# Altium schematic sheet Ricky and Min Lin - ART Robot.SchDoc: CPLD Daughter Board for Arduino Uno
size Tabloid; Date: 01/15/2011; Author: PB; CompanyName: Hikaritech inc.; DrawnBy: PB; Engineer: PB; Address1: 29-1560 Prince St; Address2: Port-Moody, BC; Address3: V3H 3W8; Address4: pbelangerconsulting@gmail.com; Revision: 1.0; SheetNumber: 1; SheetTotal: 1; ModifiedDate: 03/08/2008; ProjectName: Project Name
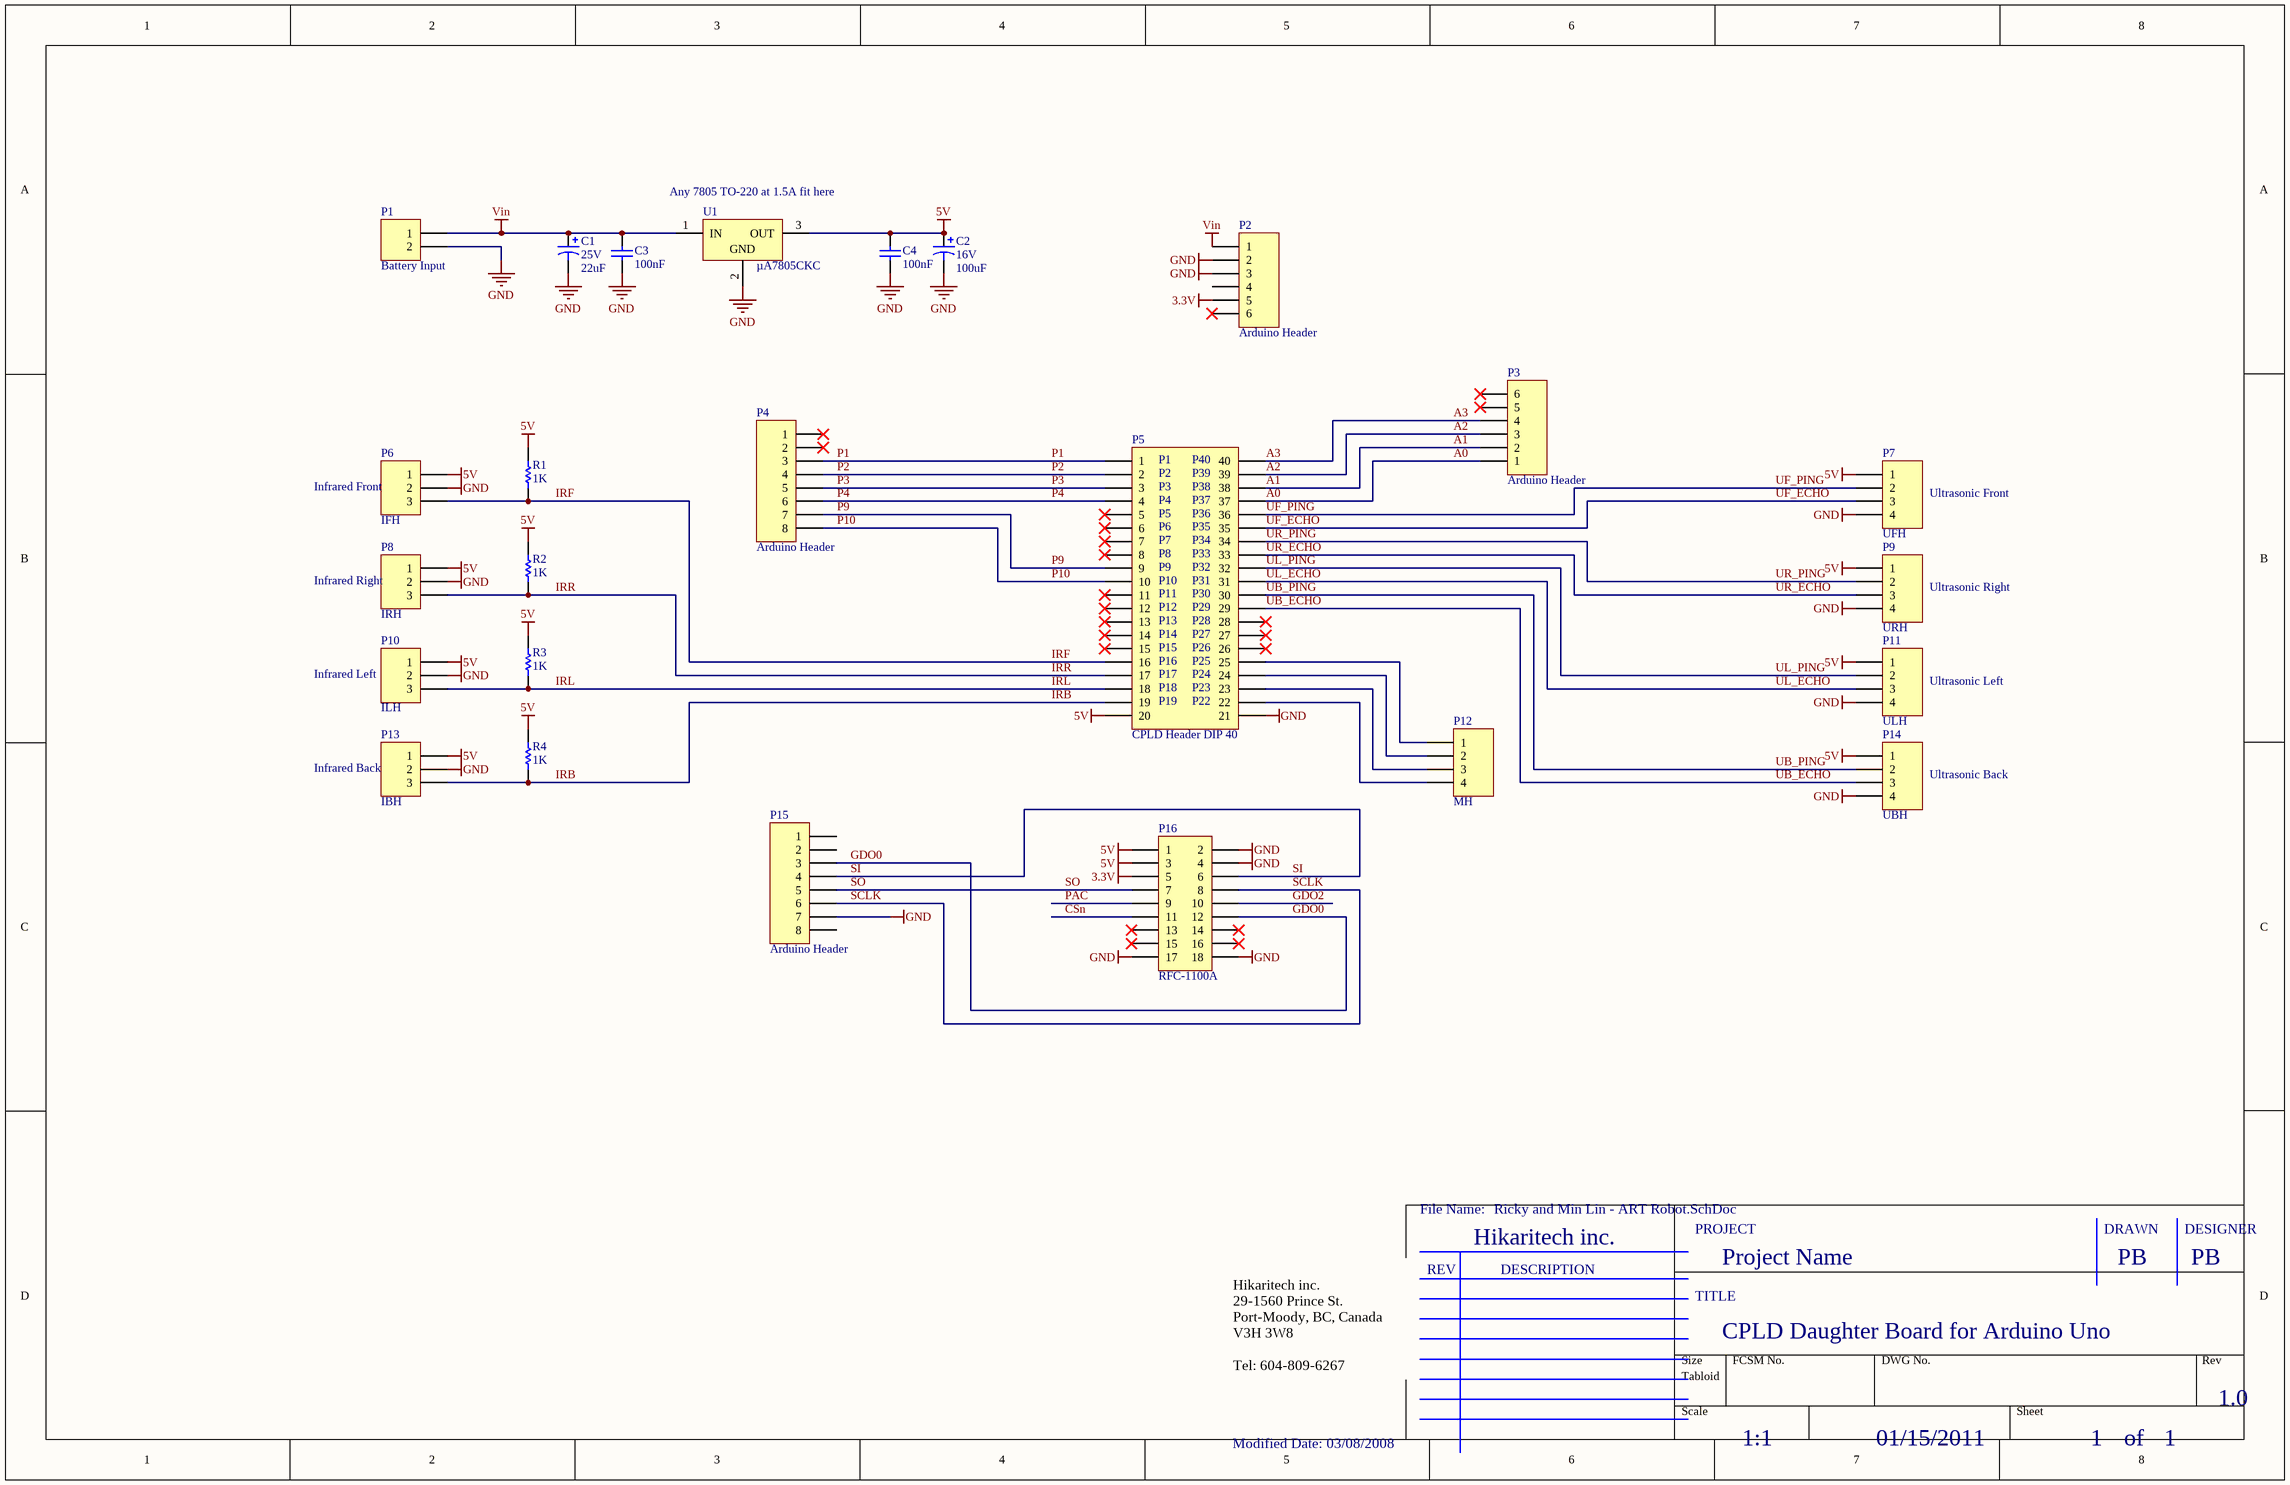
[diagram p0: Ricky and Min Lin - ART Robot.SchDoc]

## Parts
C1  25V  value 22uF  [E]
C2  16V  value 100uF  [E]
C3  value 100nF  [VP41-2.5]  (hidden comment: VP41BY104)
C4  value 100nF  [VP41-2.5]  (hidden comment: VP41BY104)
P1  Battery Input  [HDR1X2H]
P2  Arduino Header  [HDR1X6]
P3  Arduino Header  [HDR1X6]
P4  Arduino Header  [HDR1X8]
P5  CPLD Header DIP 40  [DIP-40]
P6  IFH  [HDR1X3H]
P7  UFH  [HDR1X4H]
P8  IRH  [HDR1X3H]
P9  URH  [HDR1X4H]
P10  ILH  [HDR1X3H]
P11  ULH  [HDR1X4H]
P12  MH  [HDR1X4]
P13  IBH  [HDR1X3H]
P14  UBH  [HDR1X4H]
P15  Arduino Header  [HDR1X8]
P16  RFC-1100A  [HDR2X9]
R1  value 1K  [AXIAL-0.3]  (hidden comment: Res1)
R2  value 1K  [AXIAL-0.3]  (hidden comment: Res1)
R3  value 1K  [AXIAL-0.3]  (hidden comment: Res1)
R4  value 1K  [AXIAL-0.3]  (hidden comment: Res1)
U1  µA7805CKC  [KC03]

## Nets
3.3V: P2.5 P16.5
5V: C2.1 C4.1 P5.20 P6.1 P7.1 P8.1 P9.1 P10.1 P11.1 P13.1 P14.1 P16.1 P16.3 R1.2 R2.2 R3.2 R4.2 U1.3(OUT)
GND: C1.2 C2.2 C3.2 C4.2 P1.2 P2.2 P2.3 P5.21 P6.2 P7.4 P8.2 P9.4 P10.2 P11.4 P13.2 P14.4 P15.7 P16.2 P16.4 P16.17 P16.18 U1.2(GND)
Vin: C1.1 C3.1 P1.1 P2.1 U1.1(IN)
A0: P3.1 P5.37
A1: P3.2 P5.38
A2: P3.3 P5.39
A3: P3.4 P5.40
CSn: P16.11
GDO0: P15.3 P16.12
GDO2: P16.10
IRB: P5.19 P13.3 R4.1
IRF: P5.16 P6.3 R1.1
IRL: P5.18 P10.3 R3.1
IRR: P5.17 P8.3 R2.1
P1: P4.3 P5.1
P2: P4.4 P5.2
P3: P4.5 P5.3
P4: P4.6 P5.4
P9: P4.7 P5.9
P10: P4.8 P5.10
PAC: P16.9
SCLK: P15.6 P16.8
SI: P15.4 P16.6
SO: P15.5 P16.7
UB_ECHO: P5.29 P14.3
UB_PING: P5.30 P14.2
UF_ECHO: P5.35 P7.3
UF_PING: P5.36 P7.2
UL_ECHO: P5.31 P11.3
UL_PING: P5.32 P11.2
UR_ECHO: P5.33 P9.3
UR_PING: P5.34 P9.2
NetP5_22: P5.22 P12.4
NetP5_23: P5.23 P12.3
NetP5_24: P5.24 P12.2
NetP5_25: P5.25 P12.1

Not connected (* = marked no-connect by the designer): P2 4 6*; P3 5* 6*; P4 1* 2*; P5 5* 6* 7* 8* 11* 12* 13* 14* 15* 26* 27* 28*; P15 1 2 8; P16 13* 14* 15* 16*

## Notes on the sheet
- (near U1) Any 7805 TO-220 at 1.5A fit here
- (near P6) Infrared Front
- (near P5) P1
- (near P5) P2
- (near P5) P3
- (near P5) P40
- (near P5) P39
- (near P5) P38
- (near P7) Ultrasonic Front
- (near P5) P4
- (near P5) P5
- (near P5) P6
- (near P5) P7
- (near P5) P8
- (near P5) P9
- (near P5) P37
- (near P5) P36
- (near P5) P35
- (near P5) P34
- (near P5) P33
- (near P5) P32
- (near P8) Infrared Right
- (near P5) P10
- (near P5) P11
- (near P5) P12
- (near P5) P13
- (near P5) P31
- (near P5) P30
- (near P5) P29
- (near P5) P28
- (near P9) Ultrasonic Right
- (near P10) Infrared Left
- (near P5) P14
- (near P5) P15
- (near P5) P16
- (near P5) P17
- (near P5) P18
- (near P5) P19
- (near P5) P27
- (near P5) P26
- (near P5) P25
- (near P5) P24
- (near P5) P23
- (near P5) P22
- (near P11) Ultrasonic Left
- (near P13) Infrared Back
- (near P14) Ultrasonic Back
- File Name:
- PROJECT
- DRAWN
- DESIGNER
- REV
- DESCRIPTION
- TITLE
- Hikaritech inc.
  29-1560 Prince St.
  Port-Moody, BC, Canada
  V3H 3W8
  Tel: 604-809-6267
- Modified Date:
- 1:1
- of

## Library data of the parts
C1 = 94SC226X0025EBP: Solid Aluminum Capacitor with Organic Semiconductor Electrolyte: 22uF, 25V, Bulk Pack; Note: Part Numbers shown are for ± 20% capacitance tolerance (X0).; PCB_Layout: Complies with Manufacturer's Recommendation.; DrillSize: Nominal, Rounded to the nearest 0.1mm; Published: 19-Mar-2004; DatasheetDocument: 23-May-2001; PackageReference: E; Publisher: Altium Limited; ComponentLink1Description: Manufacturer Link; ComponentLink1URL: http://www.vishay.com/; ComponentLink2Description: Datasheet; ComponentLink2URL: http://www.vishay.com/docs/90004/94sc.pdf
C2 = 94SH107X0016EBP: Solid Aluminum Capacitor with Organic Semiconductor Electrolyte: 100uF, 16V, Bulk Pack; Note: Part Numbers shown are for ± 20% capacitance tolerance (X0).; PCB_Layout: Complies with Manufacturer's Recommendation.; DrillSize: Nominal, Rounded to the nearest 0.1mm; Published: 19-Mar-2004; DatasheetDocument: 23-May-2001; PackageReference: E; Publisher: Altium Limited; ComponentLink1Description: Manufacturer Link; ComponentLink1URL: http://www.vishay.com/; ComponentLink2Description: Datasheet; ComponentLink2URL: http://www.vishay.com/docs/90006/94sh.pdf
C3 C4 = VP41BY104: Dipped Radial Multilayer Ceramic Capacitor X7R: 100nF; Note: See Datasheet for other packages & tolerances; Published: 17-Dec-2003; DatasheetDocument: 4-Feb-2002; PackageDocument: 4-Feb-2002; PackageReference: VP41-2.5; Publisher: Altium Limited; ComponentLink1Description: Manufacturer Link; ComponentLink1URL: http://www.vishay.com/
P1 = CONN 2 PIN 2.54mm Latch RA Tin: CONN 2 PINS 2.54mm Wire to Board Latch RA Tin; Manufacturer: CKMOLD; Manufacturer Part Number: 25430202; Color: Black
P2 P3 = Header 6: Header, 6-Pin; LatestRevisionDate: 17-Jul-2002; LatestRevisionNote: Re-released for DXP Platform.; Publisher: Altium Limited
P4 P15 = Header 8: Header, 8-Pin; LatestRevisionDate: 17-Jul-2002; LatestRevisionNote: Re-released for DXP Platform.; Publisher: Altium Limited
P5 = Header DIP 40: Header, 20-Pin, Dual row; LatestRevisionDate: 17-Jul-2002; LatestRevisionNote: Re-released for DXP Platform.; Publisher: Altium Limited
P6 P8 P10 P13 = CONN 3 PIN 2.54mm Latch RA Tin: CONN 3 PINS 2.54mm Wire to Board Latch RA Tin; Manufacturer: CKMOLD; Manufacturer Part Number: 25430202; Color: Black
P7 P9 P11 P14 = CONN 4 PIN 2.54mm Latch RA Tin: CONN 4 PINS 2.54mm Wire to Board Latch RA Tin; Manufacturer: CKMOLD; Manufacturer Part Number: 25430202; Color: Black
P12 = Header 4: Header, 4-Pin; LatestRevisionDate: 17-Jul-2002; LatestRevisionNote: Re-released for DXP Platform.; Publisher: Altium Limited
P16 = Header 9X2: Header, 9-Pin, Dual row; LatestRevisionDate: 17-Jul-2002; LatestRevisionNote: Re-released for DXP Platform.; Publisher: Altium Limited
R1-R4 = Res1: Resistor; Published: 8-Jun-2000; LatestRevisionDate: 17-Jul-2002; LatestRevisionNote: Re-released for DXP Platform.; PackageReference: AXIAL-0.3; Publisher: Altium Limited
U1 = µA7805CKC: Positive-Voltage Regulator; Note: Pin 2 is electrically connected to TAB.; Published: 15-Apr-2002; DatasheetVersion: Jul-1999; PackageVersion: Sep-1995; PackageReference: KC03; Publisher: Altium Limited; PackageDescription: TO, Thru-Hole, Vertical, Heatsink Mounted; 3 In-Line Leads; Pitch 2.54 mm; ComponentLink1Description: Manufacturer Link; ComponentLink1URL: http://www.ti.com/; ComponentLink2Description: Datasheet; ComponentLink2URL: http://www-s.ti.com/sc/ds/ua7805.pdf